# Altium schematic sheet LCD.SchDoc
size A4
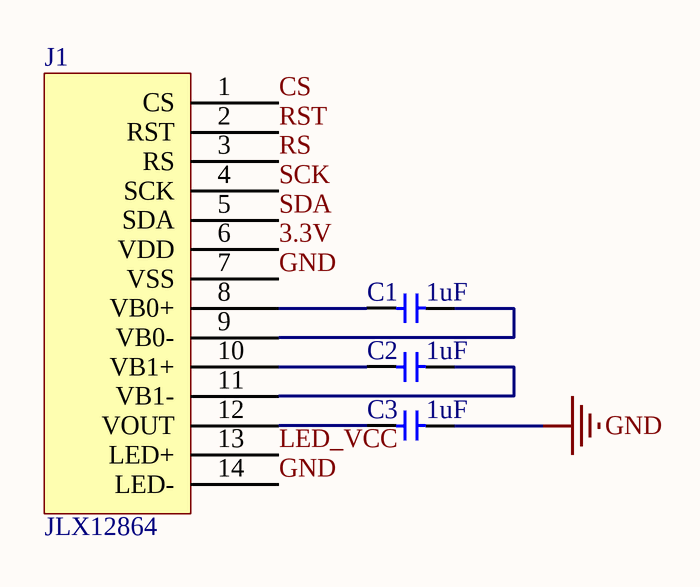
[diagram p0: LCD.SchDoc]

## Parts
C1  value 1uF  [0603-2]  (hidden comment: Cap)
C2  value 1uF  [0603-2]  (hidden comment: Cap)
C3  value 1uF  [0603-2]  (hidden comment: Cap)
J1  JLX12864  [JLX12864]

## Nets
GND: C3.2 J1.7(VSS) J1.14(LED-)
3.3V: J1.6(VDD)
CS: J1.1(CS)
LED_VCC: J1.13(LED+)
RS: J1.3(RS)
RST: J1.2(RST)
SCK: J1.4(SCK)
SDA: J1.5(SDA)
NetC1_1: C1.1 J1.8(VB0+)
NetC1_2: C1.2 J1.9(VB0-)
NetC2_1: C2.1 J1.10(VB1+)
NetC2_2: C2.2 J1.11(VB1-)
NetC3_1: C3.1 J1.12(VOUT)

## Library data of the parts
C1-C3 = Cap: 无极性电容; Published: 8-Jun-2000; LatestRevisionDate: 17-Jul-2002; LatestRevisionNote: Re-released for DXP Platform.; PackageReference: RAD-0.3; Publisher: Altium Limited
J1 = JLX12864: 12864点阵屏